# EAGLE design exp2.1 (EAGLE 9.6.2)
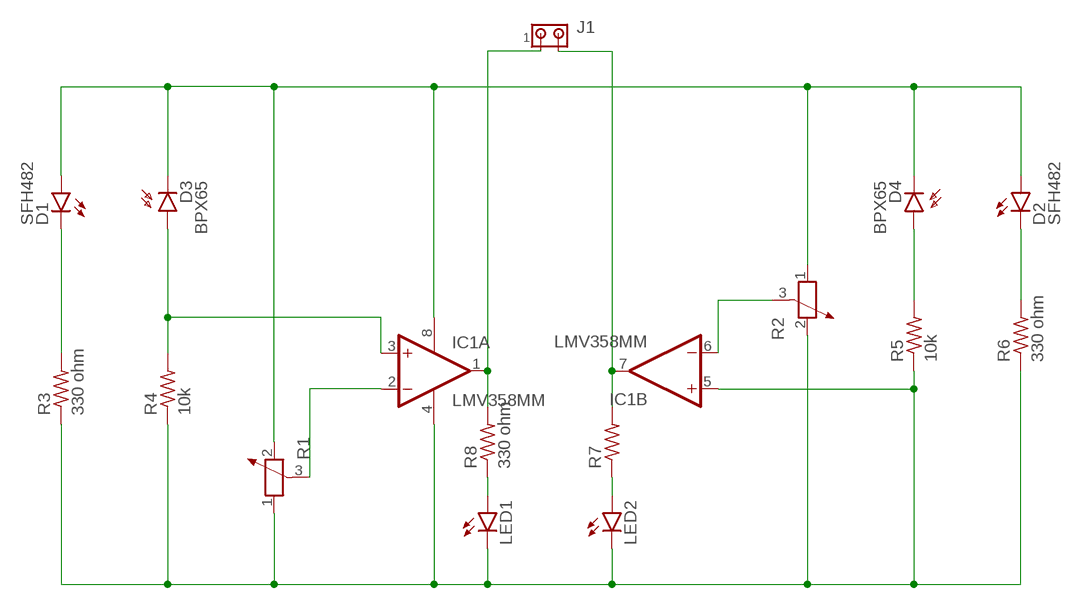
[diagram p0: schematic, sheet 1]

## Parts
D1  SFH482  [SFH482]
D2  SFH482  [SFH482]
D3  BPX65  [BPX65]
D4  BPX65  [BPX65]
IC1  LMV358MM  [MSOP08]
J1  MTA02-100  [10X02MTA]
LED1  LED3MM  [LED3MM]
LED2  LED3MM  [LED3MM]
R1  POTENTIOMETER_PT-10  [PT-10]
R2  POTENTIOMETER_PT-10  [PT-10]
R3  330 ohm  R-US_0207/10  [0207/10]
R4  10k  R-US_0207/10  [0207/10]
R5  10k  R-US_0207/10  [0207/10]
R6  330 ohm  R-US_0207/10  [0207/10]
R7  R-US_0207/10  [0207/10]
R8  330 ohm  R-US_0207/10  [0207/10]

## Nets
N$1: D1.A D2.A D3.K(C) D4.K(C) IC1.8(P:V+) R1.2 R2.1
N$2: D1.K(C) R3.2
N$3: D3.A IC1.3(A:+IN) R4.2
N$4: IC1.4(P:V-) IC1.5(B:+IN) LED1.K(C) LED2.K(C) R1.1 R2.2 R3.1 R4.1 R5.1 R6.1
N$5: D2.K(C) R6.2
N$6: D4.A R5.2
N$7: IC1.1(A:OUT) J1.1 R8.2
N$8: IC1.7(B:OUT) J1.2 R7.2
N$9: IC1.2(A:-IN) R1.3
N$10: IC1.6(B:-IN) R2.3
N$11: LED1.A R8.1
N$12: LED2.A R7.1

## Library data of the parts
D1 D2 = led:SFH482: IR LED infrared emitting diode, Infineon
D3 D4 = opto-trans-siemens:BPX65: PHOTO DIODE; MPN: BPX65.; OC_FARNELL: 327451; OC_NEWARK: 06WX2764
IC1 = linear:LMV358?*: Dual General Purpose, Low Voltage, Rail-to-Rail Output Operational Amplifiers Source: http://www.national.com/mpf/LM/LMV321.html http://www.national.com/dt/lmv_qual.pdf
J1 = con-amp:MTA02-100: AMP connector
LED1 LED2 = led:LED: LED OSRAM: - CHIPLED LG R971, LG N971, LY N971, LG Q971, LY Q971, LO R971, LY R971 LH N974, LH R974 LS Q976, LO Q976, LY Q976 LO Q996 - Hyper CHIPLED LW Q18S LB Q993, LB Q99A, LB R99A - SideLED LS A670, LO A670, LY A670, LG A670, LP A670 LB A673, LV A673, LT A673, LW A673 LH A674 LY A675 LS A676, LA A676, LO A676, LY A676, LW A676 LS A679, LY A679, LG A679 - Hyper Micro SIDELED® LS Y876, LA Y876, LO Y876, LY Y876 LT Y87S - SmartLED LW L88C, LW L88S LB L89C, LB L89S, LG L890 LS L89K, LO L89K, LY L89K LS L896, LA L896, LO L896, LY L896 - TOPLED LS T670, LO T670, LY T670, LG T670, LP T670 LSG T670, LSP T670, LSY T670, LOP T670, LYG T670 LG T671, LOG T671, LSG T671 LB T673, LV T673, LT T673, LW T673 LH T674 LS T676, LA T676, LO T676, LY T676, LB T676, LH T676, LSB T676, LW T676 LB T67C, LV T67C, LT T67C, LS T67K, LO T67K, LY T67K, LW E67C LS E67B, LA E67B, LO E67B, LY E67B, LB E67C, LV E67C, LT E67C LW T67C LS T679, LY T679, LG T679 LS T770, LO T770, LY T770, LG T770, LP T770 LB T773, LV T773, LT T773, LW T773 LH T774 LS E675, LA E675, LY E675, LS T675 LS T776, LA T776, LO T776, LY T776, LB T776 LHGB T686 LT T68C, LB T68C - Hyper Mini TOPLED® LB M676 - Mini TOPLED Santana® LG M470 LS M47K, LO M47K, LY M47K Source: http://www.osram.convergy.de LUXEON: - LUMILED® LXK2-PW12-R00, LXK2-PW12-S00, LXK2-PW14-U00, LXK2-PW14-V00 LXK2-PM12-R00, LXK2-PM12-S00, LXK2-PM14-U00 LXK2-PE12-Q00, LXK2-PE12-R00, LXK2-PE12-S00, LXK2-PE14-T00, LXK2-PE14-U00 LXK2-PB12-K00, LXK2-PB12-L00, LXK2-PB12-M00, LXK2-PB14-N00, LXK2-PB14-P00, LXK2-PB14-Q00 LXK2-PR12-L00, LXK2-PR12-M00, LXK2-PR14-Q00, LXK2-PR14-R00 LXK2-PD12-Q00, LXK2-PD12-R00, LXK2-PD12-S00 LXK2-PH12-R00, LXK2-PH12-S00 LXK2-PL12-P00, LXK2-PL12-Q00, LXK2-PL12-R00 Source: www.luxeon.com KINGBRIGHT: KA-3528ASYC Source: www.kingbright.com
R1 R2 = rcl:POTENTIOMETER_: Potentiometer; SPICEMODEL: POT; SPICEPREFIX: X
R3-R8 = rcl:R-US_: RESISTOR, American symbol; SPICEPREFIX: R

## Board
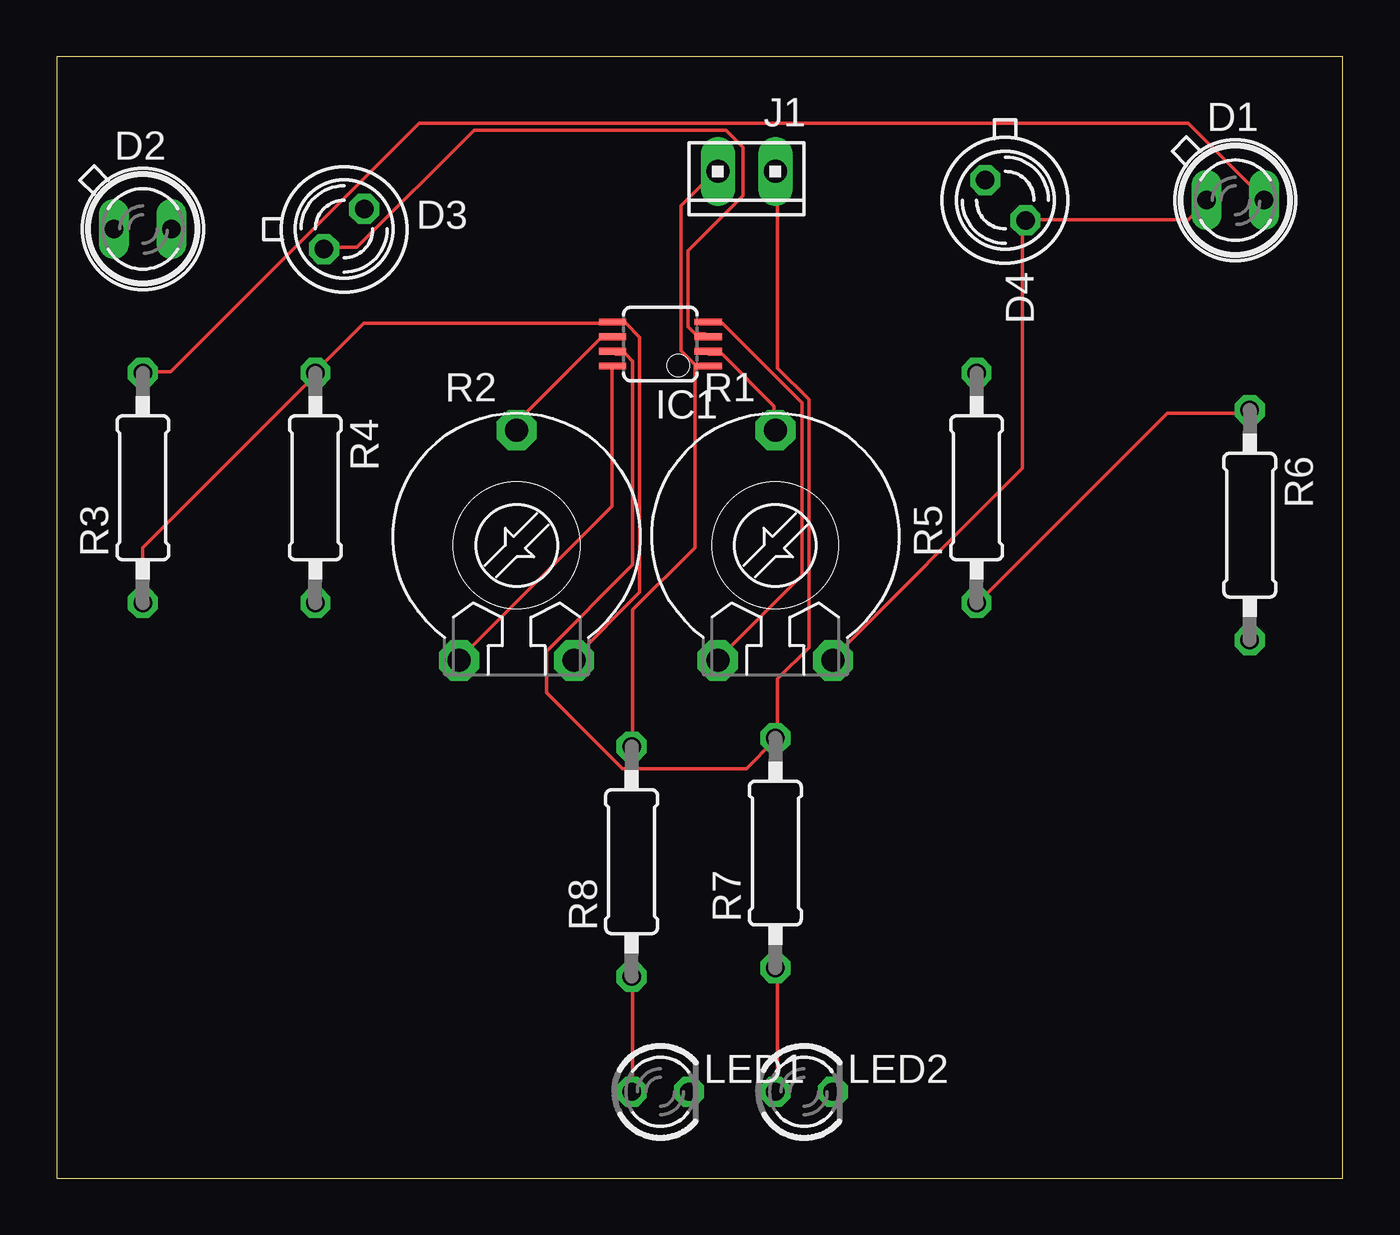
[diagram p1: board, top side]
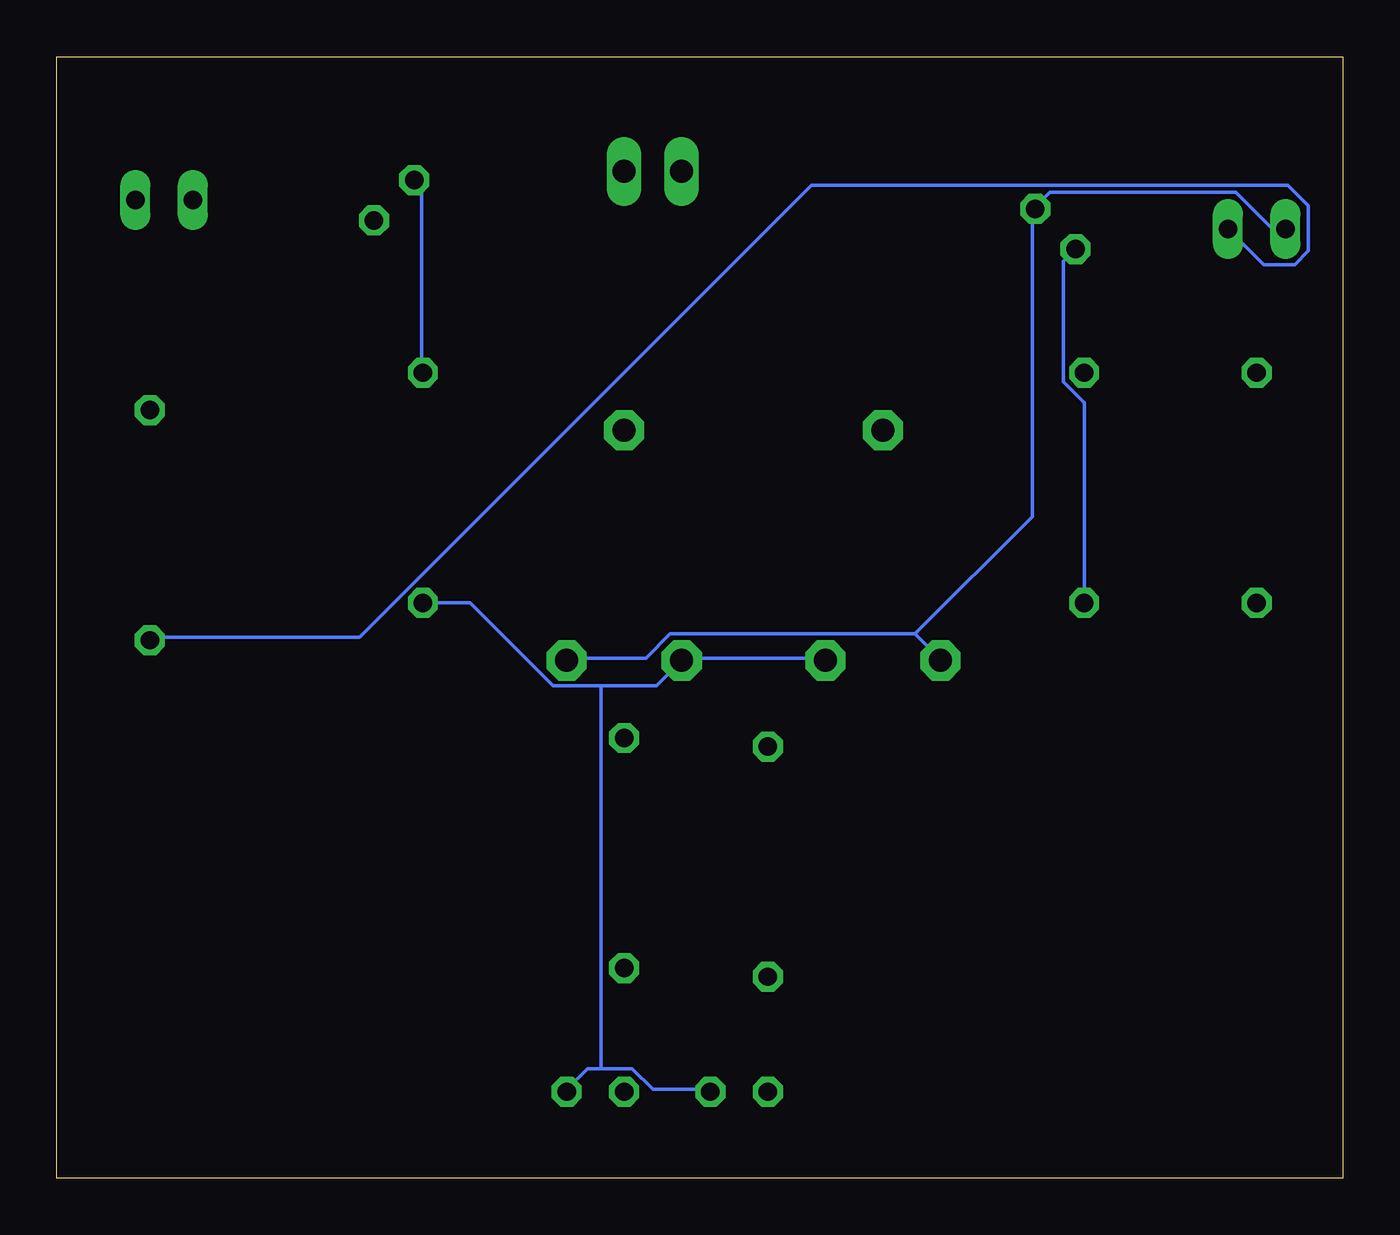
[diagram p2: board, bottom side, seen from below]

Size 56.82 x 49.52 mm. Coordinates in mm from the lower left corner, seen from the top.
Outline: 0,0 56.82,0 56.82,49.52 0,49.52 0,0
Copper layers (1*16): Top 0.035mm / dielectric 1.5mm / Bottom 0.035mm
Design rules "default": minimum track width 6mil, minimum drill 0.35mm, track to track 6mil, track to pad 6mil, pad to pad 6mil, via to via 6mil, smd to smd 6mil, copper to edge 40mil, drill to drill 6mil, minimum pad ring 10mil, minimum via ring 8mil, stop-mask expansion 4mil, vias tented up to drill 0mil, thermal gap 10mil

### Footprints (pad centres in the part's own frame; a part is rotated, then mirrored left to right if it is on the bottom)
SFH482 = drill 0.813 long: A -1.27,0; K 1.27,0
BPX65 = drill 0.813 octagon: A -0.889,-0.889; K 0.889,0.889
MSOP08 = smd 0.3 x 1.2: 1 -0.976,-2.113; 2 -0.326,-2.113; 3 0.324,-2.113; 4 0.974,-2.113; 5 0.974,2.112; 6 0.324,2.112; 7 -0.326,2.112; 8 -0.976,2.112
10X02MTA = drill 1.016 long: 1 1.27,0; 2 -1.27,0
LED3MM = drill 0.813 octagon: A -1.27,0; K 1.27,0
PT-10 = drill 1.016 pad 1.778 octagon: 1 -2.54,-5.08; 2 2.54,-5.08; 3 0,5.08
0207/10 = drill 0.813 octagon: 1 -5.08,0; 2 5.08,0

### Placement (x,y rotation side)
D1  52.07,43.18 0 top
D2  3.81,41.91 0 top
D3  12.7,41.91 0 top
D4  41.91,43.18 270 top
IC1  26.67,36.83 90 top
J1  30.48,44.45 180 top
LED1  26.67,3.81 0 top
LED2  33.02,3.81 0 top
R1  31.75,27.94 0 top
R2  20.32,27.94 0 top
R3  3.81,30.48 90 top
R4  11.43,30.48 270 top
R5  40.64,30.48 90 top
R6  52.71,28.83 270 top
R7  31.75,14.35 90 top
R8  25.4,13.97 90 top

### Tracks (layer width: path | path; a pad name or v marks a point on that pad's centre or on a via)
N$1
  Top 0.152: D1.A 50.75,43.08 49.99,42.32 42.82,42.32 D4.K 42.67,42.16 42.67,31.34 34.29,22.96 R1.2 | IC1.8 24.54,35.76 24.54,29.67 17.83,22.96 R2.1
  Bottom 0.152: D2.A 2.59,42.01 3.2,42.01 4.72,43.54 12.95,43.54 13.56,42.93 D3.K 13.72,42.77 13.72,29.21 18.9,24.03 | 18.9,24.03 29.72,24.03 30.79,22.96 34.29,22.96 R1.2 | 18.9,24.03 17.83,22.96 R2.1
N$2
  Top 0.152: R3.2 3.81,35.61 5.03,35.61 16,46.58 49.99,46.58 53.34,43.23 D1.K
N$3
  Top 0.152: IC1.3 28.65,37.29 28.19,37.29 27.89,37.59 27.89,40.95 30.33,43.38 30.33,45.52 29.57,46.28 18.44,46.28 13.26,41.1 11.89,41.1 D3.A
  Bottom 0.152: R4.2 11.43,34.24 12.34,35.15 12.34,40.49 D3.A
N$4
  Top 0.152: R3.1 3.81,27.84 11.43,35.46 R4.1 11.43,35.61 13.56,37.74 24.54,37.74 IC1.5 24.69,37.74 25.15,37.74 25.76,37.13 25.76,25.86 22.86,22.96 R2.2 | IC1.4 28.8,37.74 29.41,37.74 32.92,34.24 32.92,26.62 29.26,22.96 R1.1 | R6.1 52.58,33.78 49.07,33.78 40.69,25.4 R5.1
  Bottom 0.152: 32.77,4.83 33.38,4.83 34.29,3.91 LED2.K | 32.77,4.83 31.39,4.83 30.48,3.91 28.04,3.91 LED1.K | R5.1 38.56,25.4 34.9,21.74 32.77,21.74 | 32.77,21.74 30.33,21.74 R1.1 29.11,22.96 22.86,22.96 R2.2 | 32.77,21.74 32.77,4.83
N$5
  Bottom 0.152: D2.K 3.51,40.33 2.13,40.33 1.52,40.95 1.52,42.93 2.44,43.84 23.47,43.84 43.43,23.88 52.58,23.88 R6.2
N$6
  Bottom 0.152: R5.2 40.69,35.61 40.69,43.69 41,43.99 D4.A
N$7
  Top 0.152: 28.19,35.92 28.65,35.92 IC1.1 28.19,35.92 | 28.19,35.92 27.58,36.52 27.58,42.93 29.11,44.45 J1.1 | 28.19,35.92 28.19,27.84 25.45,25.09 25.45,19.15 R8.2
N$8
  Top 0.152: IC1.7 24.69,36.37 25.15,36.37 25.45,36.07 25.45,27.08 21.64,23.27 21.64,21.44 24.99,18.09 30.48,18.09 31.7,19.3 R7.2 31.85,19.46 31.85,22.05 33.22,23.42 33.22,34.39 31.85,35.76 31.85,44.45 J1.2
N$9
  Top 0.152: IC1.2 28.8,36.37 29.41,36.37 31.7,34.09 31.7,33.02 R1.3
N$10
  Top 0.152: IC1.6 24.54,37.13 24.08,37.13 20.42,33.48 20.42,33.02 R2.3
N$11
  Top 0.152: LED1.A 25.45,3.91 25.45,8.79 R8.1
N$12
  Top 0.152: LED2.A 31.85,3.91 31.85,9.25 R7.1